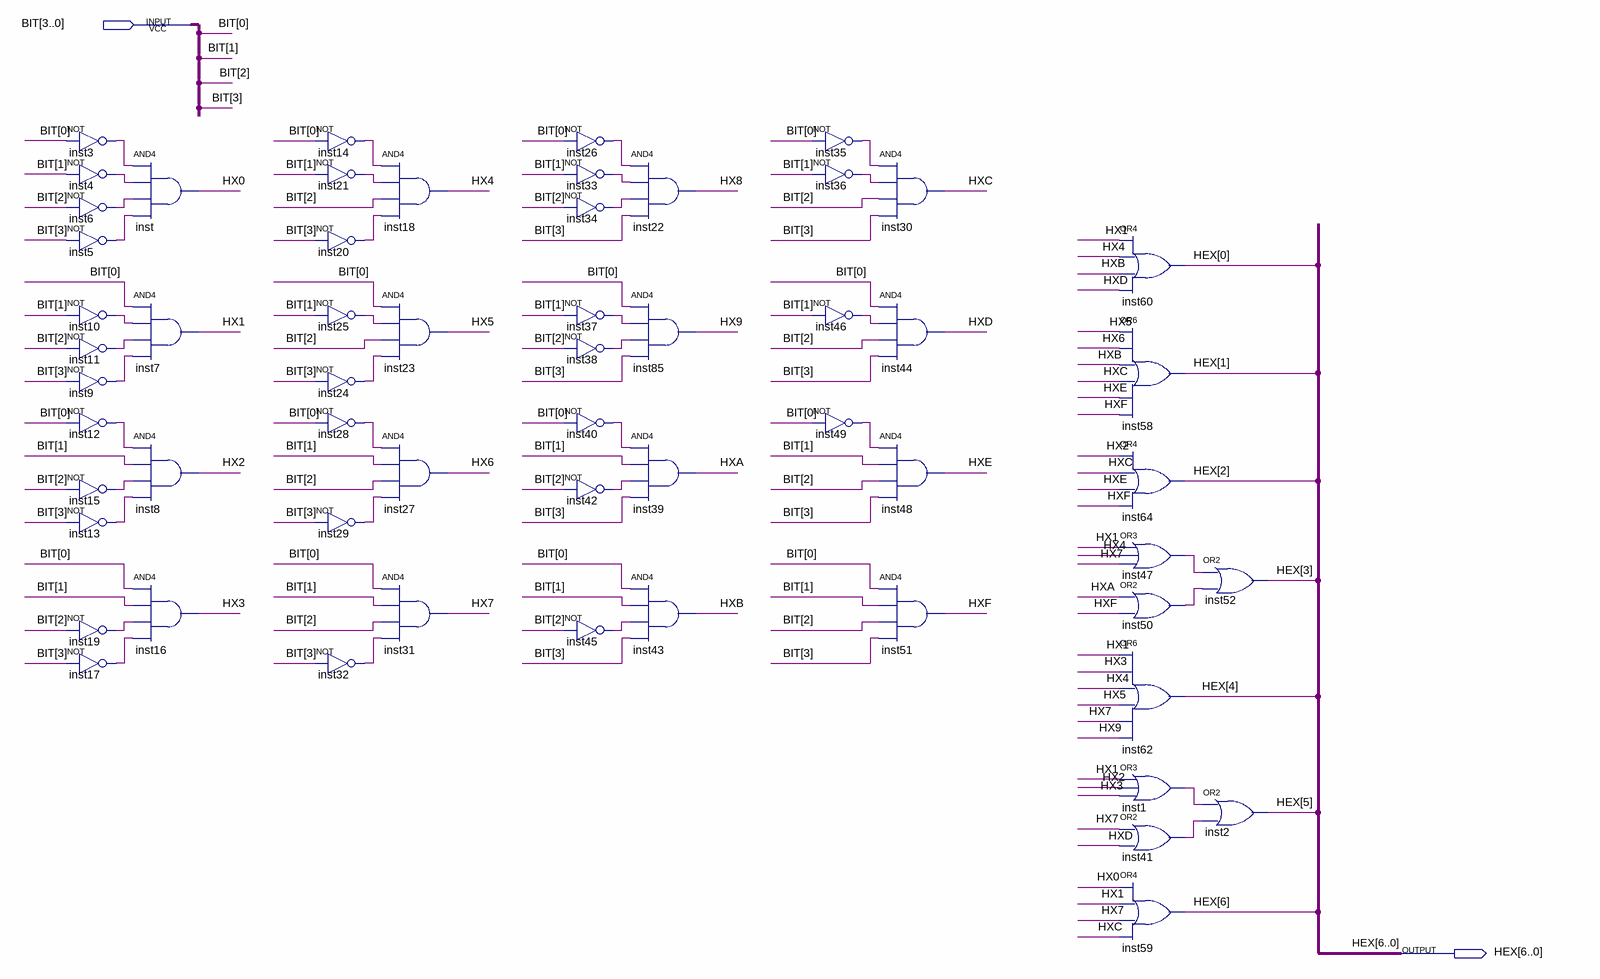
[diagram p0: schematic sheet]
// Quartus schematic hex_display.bdf as structural Verilog: 59 symbols, 2 pins
module hex_display (
  input  [3:0] BIT,
  output [6:0] HEX
);

  wire HX0, HX1, HX2, HX3, HX4, HX5, HX6, HX7, HX8, HX9, HXA, HXB, HXC, HXD, HXE, HXF, inst1_out, inst3_out,
       inst4_out, inst5_out, inst6_out, inst9_out, inst10_out, inst11_out, inst12_out, inst13_out,
       inst14_out, inst15_out, inst17_out, inst19_out, inst20_out, inst21_out, inst24_out, inst25_out,
       inst26_out, inst28_out, inst29_out, inst32_out, inst33_out, inst34_out, inst35_out, inst36_out,
       inst37_out, inst38_out, inst40_out, inst41_out, inst42_out, inst45_out, inst46_out, inst47_out,
       inst49_out, inst50_out;

  not inst3 (inst3_out, BIT[0]);
  not inst4 (inst4_out, BIT[1]);
  not inst6 (inst6_out, BIT[2]);
  not inst5 (inst5_out, BIT[3]);
  not inst10 (inst10_out, BIT[1]);
  not inst11 (inst11_out, BIT[2]);
  not inst9 (inst9_out, BIT[3]);
  not inst12 (inst12_out, BIT[0]);
  not inst15 (inst15_out, BIT[2]);
  not inst13 (inst13_out, BIT[3]);
  not inst19 (inst19_out, BIT[2]);
  not inst17 (inst17_out, BIT[3]);
  and inst (HX0, inst3_out, inst4_out, inst6_out, inst5_out);
  and inst7 (HX1, BIT[0], inst10_out, inst11_out, inst9_out);
  and inst8 (HX2, inst12_out, BIT[1], inst15_out, inst13_out);
  and inst16 (HX3, BIT[0], BIT[1], inst19_out, inst17_out);
  not inst14 (inst14_out, BIT[0]);
  not inst21 (inst21_out, BIT[1]);
  not inst20 (inst20_out, BIT[3]);
  not inst25 (inst25_out, BIT[1]);
  not inst24 (inst24_out, BIT[3]);
  not inst28 (inst28_out, BIT[0]);
  not inst29 (inst29_out, BIT[3]);
  not inst32 (inst32_out, BIT[3]);
  and inst18 (HX4, inst14_out, inst21_out, BIT[2], inst20_out);
  and inst23 (HX5, BIT[0], inst25_out, BIT[2], inst24_out);
  and inst27 (HX6, inst28_out, BIT[1], BIT[2], inst29_out);
  and inst31 (HX7, BIT[0], BIT[1], BIT[2], inst32_out);
  not inst26 (inst26_out, BIT[0]);
  not inst33 (inst33_out, BIT[1]);
  not inst34 (inst34_out, BIT[2]);
  not inst37 (inst37_out, BIT[1]);
  not inst38 (inst38_out, BIT[2]);
  not inst40 (inst40_out, BIT[0]);
  not inst42 (inst42_out, BIT[2]);
  not inst45 (inst45_out, BIT[2]);
  and inst22 (HX8, inst26_out, inst33_out, inst34_out, BIT[3]);
  and inst85 (HX9, BIT[0], inst37_out, inst38_out, BIT[3]);
  and inst39 (HXA, inst40_out, BIT[1], inst42_out, BIT[3]);
  and inst43 (HXB, BIT[0], BIT[1], inst45_out, BIT[3]);
  not inst35 (inst35_out, BIT[0]);
  not inst36 (inst36_out, BIT[1]);
  not inst46 (inst46_out, BIT[1]);
  not inst49 (inst49_out, BIT[0]);
  and inst30 (HXC, inst35_out, inst36_out, BIT[2], BIT[3]);
  and inst44 (HXD, BIT[0], inst46_out, BIT[2], BIT[3]);
  and inst48 (HXE, inst49_out, BIT[1], BIT[2], BIT[3]);
  and inst51 (HXF, BIT[0], BIT[1], BIT[2], BIT[3]);
  or inst60 (HEX[0], HX1, HX4, HXB, HXD);
  or inst58 (HEX[1], HX5, HX6, HXB, HXC, HXE, HXF);
  or inst64 (HEX[2], HX2, HXC, HXE, HXF);
  or inst47 (inst47_out, HX1, HX4, HX7);
  or inst50 (inst50_out, HXA, HXF);
  or inst62 (HEX[4], HX1, HX3, HX4, HX5, HX7, HX9);
  or inst1 (inst1_out, HX1, HX2, HX3);
  or inst41 (inst41_out, HX7, HXD);
  or inst59 (HEX[6], HX0, HX1, HX7, HXC);
  or inst52 (HEX[3], inst47_out, inst50_out);
  or inst2 (HEX[5], inst1_out, inst41_out);
endmodule
